# EAGLE design gl827 (EAGLE 7.6.0)
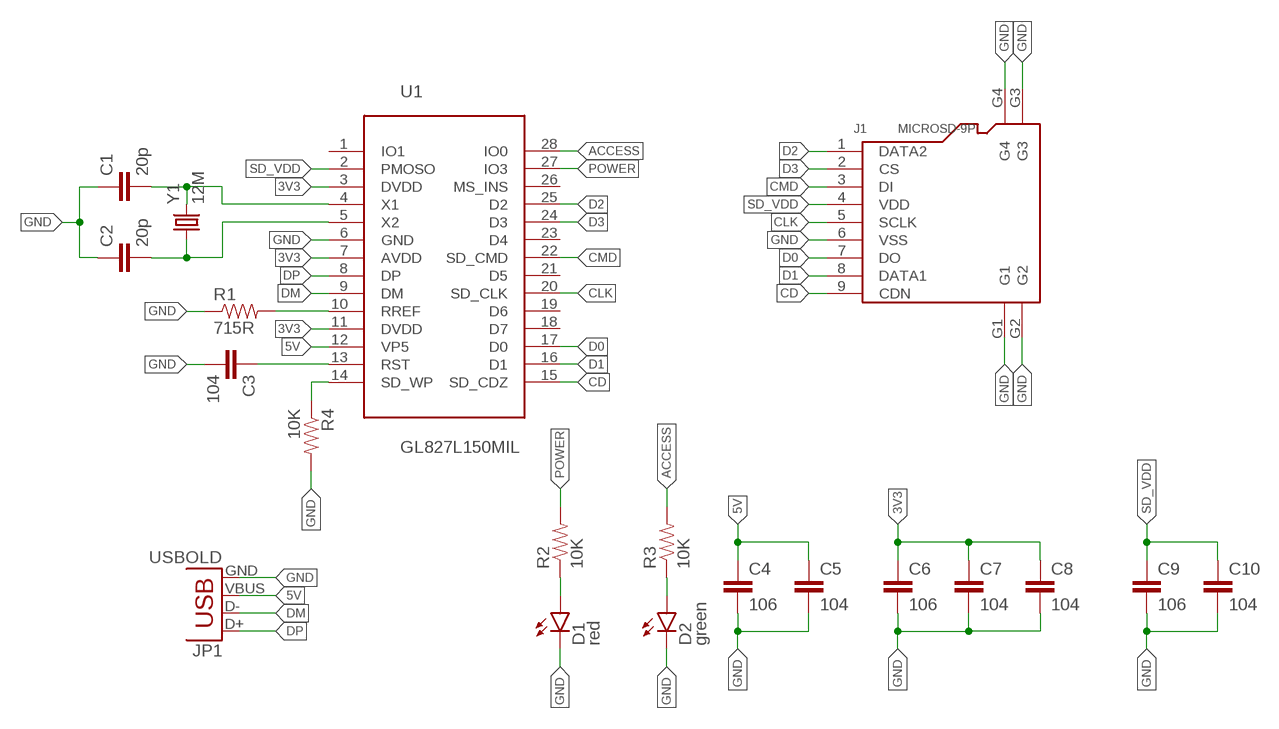
[diagram p0: schematic, sheet 1]

## Parts
C1  20p  CAP0402-CAP  [0402-CAP]
C2  20p  CAP0402-CAP  [0402-CAP]
C3  104  CAP0402-CAP  [0402-CAP]
C4  106  CAP0402-CAP  [0402-CAP]
C5  104  CAP0402-CAP  [0402-CAP]
C6  106  CAP0402-CAP  [0402-CAP]
C7  104  CAP0402-CAP  [0402-CAP]
C8  104  CAP0402-CAP  [0402-CAP]
C9  106  CAP0402-CAP  [0402-CAP]
C10  104  CAP0402-CAP  [0402-CAP]
D1  red  LED-EASY  [LED-0603-EASY]
D2  green  LED-EASY  [LED-0603-EASY]
J1  MICROSD-9P  MICRO-SD-CARD-HOLDER-9P  [MICRO-SD9+4P-SMD-16.1X14.5X1.85MM]
JP1  USBOLD  [USB-MINIB-OLD]
R1  715R  RESISTOR0603  [0603-RES]
R2  10K  RESISTOR0402  [0402-RES]
R3  10K  RESISTOR0402  [0402-RES]
R4  10K  RESISTOR0402  [0402-RES]
U1  GL827L150MIL  [SSOP28-39]
Y1  12M  CRYSTAL2HC49US  [HC49US]

## Nets
3V3: C6.1 C7.1 C8.1 U1.3(DVDD) U1.7(AVDD) U1.11(DVDD)
5V: C4.1 C5.1 JP1.VBUS U1.12(VP5)
ACCESS: R3.2 U1.28(IO0)
CD: J1.9(CDN) U1.15(SD_CDZ)
CLK: J1.5(SCLK) U1.20(SD_CLK)
CMD: J1.3(DI) U1.22(SD_CMD)
D0: J1.7(DO) U1.17(D0)
D1: J1.8(DATA1) U1.16(D1)
D2: J1.1(DATA2) U1.25(D2)
D3: J1.2(CS) U1.24(D3)
DM: JP1.D- U1.9(DM)
DP: JP1.D+ U1.8(DP)
GND: C1.1 C2.1 C3.2 C4.2 C5.2 C6.2 C7.2 C8.2 C9.2 C10.2 D1.-(C) D2.-(C) J1.6(VSS) J1.G1 J1.G2 J1.G3 J1.G4 JP1.GND R1.1 R4.2 U1.6(GND)
N$1: C1.2 U1.4(X1) Y1.2
N$2: C2.2 U1.5(X2) Y1.1
N$3: R1.2 U1.10(RREF)
N$4: C3.1 U1.13(RST)
N$5: R4.1 U1.14(SD_WP)
N$6: D2.+(A) R3.1
N$8: D1.+(A) R2.1
POWER: R2.2 U1.27(IO3)
SD_VDD: C9.1 C10.1 J1.4(VDD) U1.2(PMOSO)
Unconnected: U1.1(IO1) U1.18(D7) U1.19(D6) U1.21(D5) U1.23(D4) U1.26(MS_INS)

## Library data of the parts
C1-C10 = z_jlc_smt:CAP: Capacitor Standard 0603 ceramic capacitor, and 0.1" leaded capacitor.
D1 D2 = z_jlc_smt:LED: LEDs Standard schematic elements and footprints for 5mm, 3mm, 1206, and 0603 sized LEDs. 5mm - Spark Fun Electronics SKU : COM-00529 (and others)
J1 = Seeed-OPL-Connector:MICRO-SD-CARD-HOLDER-9P: 320090008
JP1 = xmgu2008:USB: USB Connectors USB-B-PTH is fully proven SKU : PRT-00139/CONN-08278 USB-miniB is fully proven SKU : PRT-00587 USB-A-PCB is untested. USB-A-H is throughly reviewed, but untested. Spark Fun Electronics SKU : PRT-00437 USB-B-SMT is throughly reviewed, but untested. Needs silkscreen touching up. USB-A-S has not been used/tested USB-MB-H has not been used/tested USB-MICROB has been used. CONN-09505
R1-R4 = z_jlc_smt:RESISTOR: Resistor Basic schematic elements and footprints for 0603, 1206, and PTH resistors.
U1 = xmgu2008:GL827L
Y1 = xmgu2008:CRYSTAL2: Various standard crystals. Proven footprints.

## Board
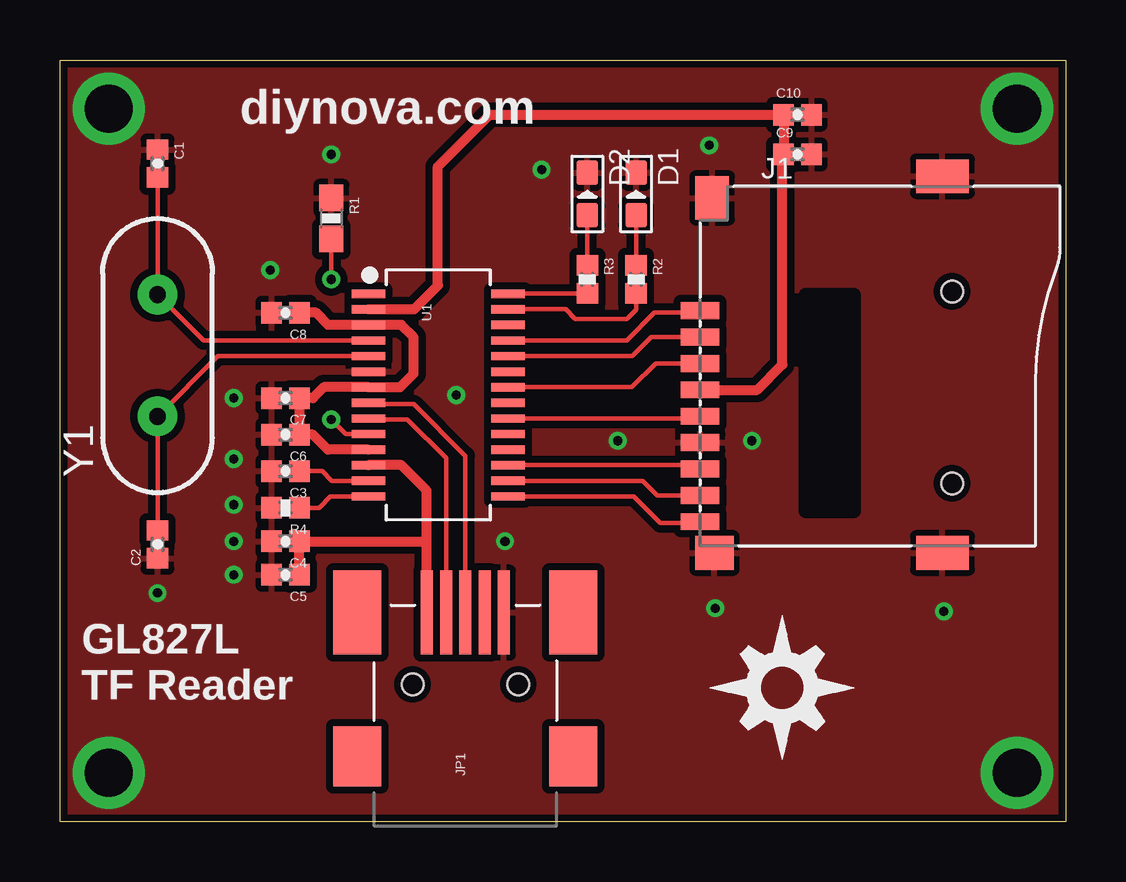
[diagram p1: board, top side]
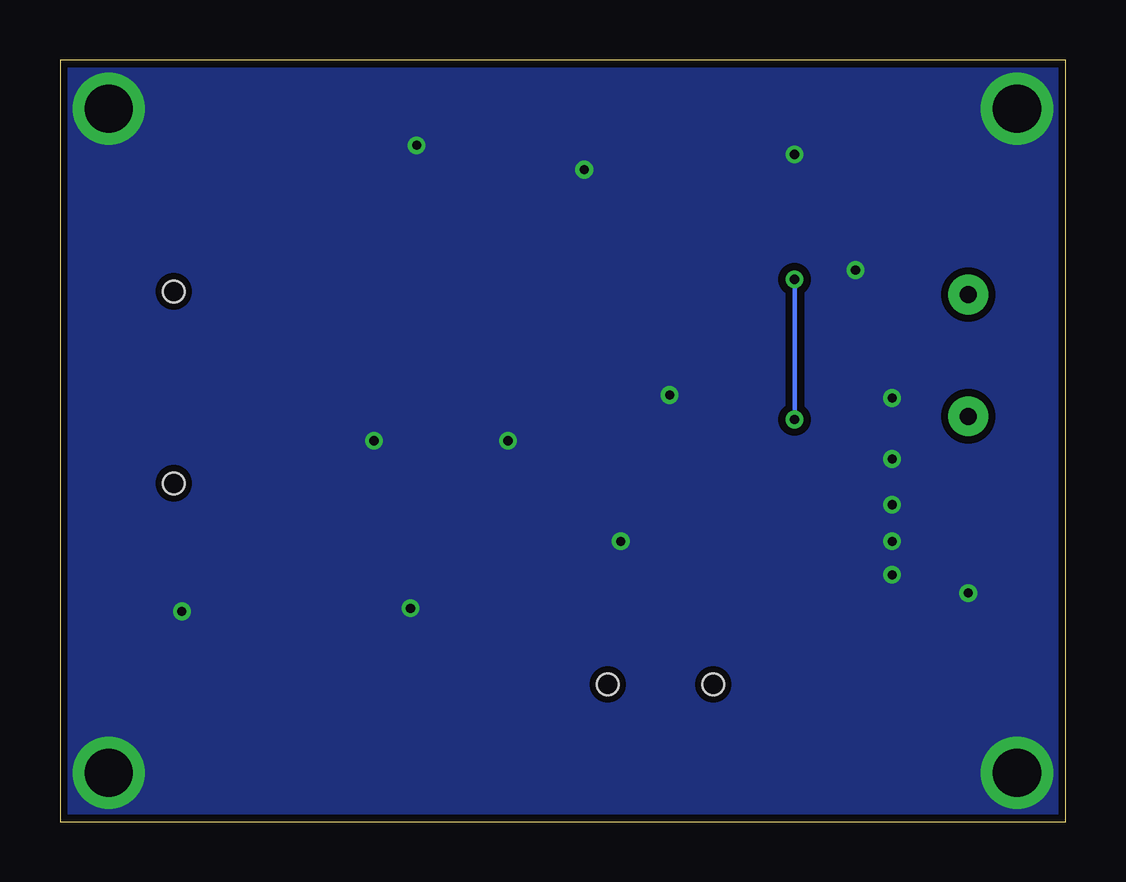
[diagram p2: board, bottom side, seen from below]

Size 41.91 x 31.75 mm. Coordinates in mm from the lower left corner, seen from the top.
Outline: 0,0 0,31.75 41.91,31.75 41.91,0 0,0
Copper layers (1*16): Top 0.035mm / dielectric 1.5mm / Bottom 0.035mm
Design rules "SparkFun-2-layer-TIGHT": minimum track width 7mil, minimum drill 15mil, track to track 7mil, track to pad 7mil, pad to pad 7mil, via to via 7mil, smd to smd 7mil, copper to edge 7mil, drill to drill 7mil, minimum pad ring 7mil, minimum via ring 7mil, stop-mask expansion 4mil, vias tented up to drill 20mil, thermal gap 10mil

### Footprints (pad centres in the part's own frame; a part is rotated, then mirrored left to right if it is on the bottom)
0402-CAP = smd 0.85 x 0.9: 1 -0.58,0; 2 0.58,0
LED-0603-EASY = smd 1.016 x 0.889: + 0.889,0; - -0.889,0
MICRO-SD9+4P-SMD-16.1X14.5X1.85MM = smd 1.6 x 0.7: 1 0,2.25; 2 0,1.15; 3 0,0.05; 4 0,-1.05; 5 0,-2.15; 6 0,-3.25; 7 0,-4.35; 8 0,-5.45; 9 0,-6.55 | smd 1.6 x 1.4: G1 0.6,-7.85 | smd 2.2 x 1.4: G2 10.1,-7.85; G3 10.1,7.85 | smd 1.4 x 1.8: G4 0.5,6.95 | hole 0.9: 10.5,-4.95; 10.5,3.05
USB-MINIB-OLD = smd 2.5 x 2: 1 -3,-4.5; 2 -3,4.5 | smd 3.5 x 2: 3 3,-4.5; 4 3,4.5 | smd 3.5 x 0.5: D+ 3,0; D- 3,0.8; GND 3,-1.6; ID 3,-0.8; VBUS 3.01,1.61 | hole 0.9: 0,2.2; 0,-2.2
0603-RES = smd 1.1 x 1: 1 -0.85,0; 2 0.85,0
0402-RES = smd 0.85 x 0.9: 1 -0.58,0; 2 0.58,0
SSOP28-39 = smd 0.348 x 1.397: 1 -4.225,-3.656; 2 -3.575,-3.656; 3 -2.925,-3.656; 4 -2.275,-3.656; 5 -1.625,-3.656; 6 -0.975,-3.656; 7 -0.325,-3.656; 8 0.325,-3.656; 9 0.975,-3.656; 10 1.625,-3.656; 11 2.275,-3.656; 12 2.925,-3.656; 13 3.575,-3.656; 14 4.225,-3.656; 15 4.225,2.156; 16 3.575,2.156; 17 2.925,2.156; 18 2.275,2.156; 19 1.625,2.156; 20 0.975,2.156; 21 0.325,2.156; 22 -0.325,2.156; 23 -0.975,2.156; 24 -1.625,2.156; 25 -2.275,2.156; 26 -2.925,2.156; 27 -3.575,2.156; 28 -4.225,2.156
HC49US = drill 0.7 pad 1.651: 1 -2.54,0; 2 2.54,0

### Placement (x,y rotation side)
C1  4.06,27.43 270 top
C2  4.06,11.56 90 top
C3  9.4,14.61 180 top
C4  9.4,11.68 180 top
C5  9.4,10.29 180 top
C6  9.4,16.13 180 top
C7  9.4,17.65 180 top
C8  9.4,21.21 180 top
C9  30.73,27.81 0 top
C10  30.73,29.46 0 top
D1  24,26.16 270 top
D2  21.97,26.16 270 top
J1  26.67,19.05 0 top
JP1  16.89,5.71 90 top
R1  11.3,25.15 270 top
R2  24,22.61 270 top
R3  21.97,22.61 270 top
R4  9.4,13.08 180 top
U1  16.51,17.78 270 top
U$1  [DIYNOVA_LOGO]  27.05,2.54 0 top
Y1  4.06,19.43 90 top

### Tracks (layer width: path | path; a pad name or v marks a point on that pad's centre or on a via)
3V3
  Top 0.406: C8.1 10.67,21.21 11.17,20.7 U1.3 14.22,20.7 14.73,20.19 14.73,18.67 14.17,18.11 U1.7 10.99,18.11 10.54,17.65 C7.1 C6.1 10.54,16.13 11.16,15.51 U1.11
5V
  Top 0.406: JP1.VBUS 15.28,11.68 | 15.28,11.68 15.28,13.8 14.22,14.86 U1.12 | 15.28,11.68 C4.1 C5.1
ACCESS
  Top 0.178: U1.28 21.95,22 R3.2
CD
  Top 0.178: U1.15 23.91,13.55 25.02,12.45 26.62,12.45 J1.9
CLK
  Top 0.178: U1.20 26.57,16.8 J1.5
CMD
  Top 0.178: U1.22 23.82,18.11 24.82,19.1 J1.3
D0
  Top 0.178: U1.17 26.52,14.86 J1.7
D1
  Top 0.178: U1.16 24.28,14.21 24.89,13.59 26.66,13.59 J1.8
D2
  Top 0.178: U1.25 23.61,20.05 24.77,21.21 26.58,21.21 J1.1
D3
  Top 0.178: U1.24 23.85,19.41 24.64,20.19 J1.2
DM
  Top 0.178: JP1.D- 16.09,15.15 14.48,16.76 12.89,16.76 U1.9
DP
  Top 0.178: JP1.D+ 16.89,15.24 14.73,17.4 12.91,17.4 U1.8
GND  (via drill 0.38, 2.01)
  other vias: 2.03,29.72 2.03,2.03 39.88,2.03 39.88,29.72 27.3,8.89 36.83,8.76 27.05,28.19 23.24,15.88 28.83,15.88 20.07,27.18 16.51,17.78 18.54,11.68 7.24,11.68 4.06,9.53 11.3,27.81 8.76,22.99 7.24,17.65 7.24,15.11 7.24,13.21 7.24,10.29
  pour Top (isolate 0.305): 0,0 0,31.75 41.91,31.75 41.91,0
  pour Bottom (isolate 0.305): 0,0 0,31.75 41.91,31.75 41.91,0
N$1
  Top 0.178: U1.4 5.98,20.05 Y1.2 C1.2
N$2
  Top 0.178: U1.5 6.58,19.41 Y1.1 C2.2
N$3  (via drill 0.38)
  Top 0.178: R1.2 v11.3,22.61 | U1.10 11.91,16.16 v11.3,16.76
  Bottom 0.178: v11.3,22.61 v11.3,16.76
N$4
  Top 0.178: U1.13 11.32,14.21 10.92,14.61 C3.1
N$5
  Top 0.178: U1.14 11.27,13.55 10.79,13.08 R4.1
N$6
  Top 0.178: R3.1 D2.+
N$8
  Top 0.178: R2.1 D1.+
POWER
  Top 0.178: U1.27 21.06,21.36 21.46,20.95 23.62,20.95 24,21.34 R2.2
SD_VDD
  Top 0.406: U1.2 14.75,21.36 15.75,22.35 15.75,27.3 17.91,29.46 C10.1 C9.1 30.1,27.76 30.1,19.05 29.05,18 J1.4

### Text on the board
tPlace: diynova.com | GL827L / TF Reader